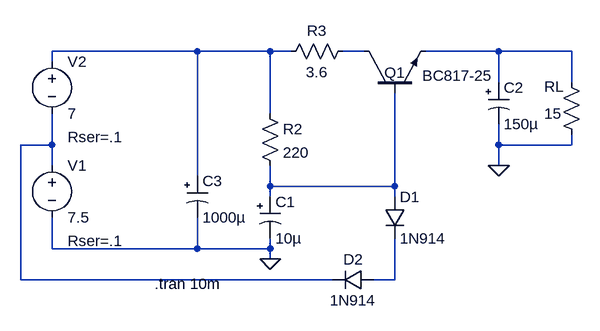
[diagram p0: schematic Ctc7v5Reg.asc]
Ctc7v5Reg.asc, the LTspice schematic file:
Version 4
SHEET 1 880 680
WIRE -96 96 -320 96
WIRE 16 96 -96 96
WIRE 48 96 16 96
WIRE 160 96 128 96
WIRE 368 96 256 96
WIRE 480 96 368 96
WIRE -320 112 -320 96
WIRE 368 144 368 96
WIRE 480 144 480 96
WIRE 16 192 16 96
WIRE -320 240 -320 192
WIRE -320 240 -368 240
WIRE 368 240 368 208
WIRE 480 240 480 224
WIRE 480 240 368 240
WIRE -320 272 -320 240
WIRE 368 272 368 240
WIRE -96 288 -96 96
WIRE 16 304 16 272
WIRE 208 304 208 160
WIRE 208 304 16 304
WIRE 16 320 16 304
WIRE 208 320 208 304
WIRE -320 400 -320 352
WIRE -96 400 -96 352
WIRE -96 400 -320 400
WIRE 16 400 16 384
WIRE 16 400 -96 400
WIRE 16 416 16 400
WIRE -368 448 -368 240
WIRE 112 448 -368 448
WIRE 208 448 208 384
WIRE 208 448 176 448
FLAG 16 416 0
FLAG 368 272 0
SYMBOL npn2 160 160 R270
WINDOW 0 31 32 VRight 0
WINDOW 3 27 90 VRight 0
SYMATTR InstName Q1
SYMATTR Value BC817-25
SYMBOL polcap 0 320 R0
WINDOW 3 24 64 Left 0
SYMATTR InstName C1
SYMATTR Value 10µ
SYMATTR Description Capacitor
SYMATTR Type cap
SYMATTR SpiceLine V=63 Irms=170m Rser=1 Lser=0 mfg="Nichicon" pn="UPG1J100MPH" type="Al electrolytic"
SYMBOL diode 192 320 R0
SYMATTR InstName D1
SYMATTR Value 1N914
SYMBOL res 0 176 R0
SYMATTR InstName R2
SYMATTR Value 220
SYMBOL res 144 80 R90
WINDOW 0 0 56 VBottom 0
WINDOW 3 32 56 VTop 0
SYMATTR InstName R3
SYMATTR Value 3.6
SYMBOL polcap 352 144 R0
WINDOW 3 24 64 Left 0
SYMATTR InstName C2
SYMATTR Value 150µ
SYMATTR Description Capacitor
SYMATTR Type cap
SYMATTR SpiceLine V=10 Irms=265m Rser=0.35 Lser=0 mfg="Nichicon" pn="UPL1A151MPH" type="Al electrolytic"
SYMBOL res 464 128 R0
WINDOW 0 -26 22 Left 0
WINDOW 3 -26 64 Left 0
SYMATTR InstName RL
SYMATTR Value 15
SYMBOL voltage -320 256 R0
WINDOW 123 0 0 Left 0
WINDOW 39 24 132 Left 0
SYMATTR InstName V1
SYMATTR Value 7.5
SYMATTR SpiceLine Rser=.1
SYMBOL voltage -320 96 R0
WINDOW 123 0 0 Left 0
WINDOW 39 24 132 Left 0
SYMATTR InstName V2
SYMATTR Value 7
SYMATTR SpiceLine Rser=.1
SYMBOL polcap -112 288 R0
WINDOW 3 24 64 Left 0
SYMATTR InstName C3
SYMATTR Value 1000µ
SYMATTR Description Capacitor
SYMATTR Type cap
SYMATTR SpiceLine V=16 Irms=1.41 Rser=0.047 Lser=0 mfg="Nichicon" pn="UPL1C102MPH" type="Al electrolytic"
SYMBOL diode 176 432 R90
WINDOW 0 0 32 VBottom 0
WINDOW 3 32 32 VTop 0
SYMATTR InstName D2
SYMATTR Value 1N914
TEXT -162 454 Left 0 !.tran 10m

The netlist it stands for:
* Ctc7v5Reg.asc
Q1 N002 N005 N003 0 BC817-25
C1 N005 0 10µ V=63 Irms=170m Rser=1 Lser=0 mfg="Nichicon" pn="UPG1J100MPH" type="Al electrolytic"
D1 N005 N006 1N914
R2 N001 N005 220
R3 N002 N001 3.6
C2 N003 0 150µ V=10 Irms=265m Rser=0.35 Lser=0 mfg="Nichicon" pn="UPL1A151MPH" type="Al electrolytic"
RL N003 0 15
V1 N004 0 7.5 Rser=.1
V2 N001 N004 7 Rser=.1
C3 N001 0 1000µ V=16 Irms=1.41 Rser=0.047 Lser=0 mfg="Nichicon" pn="UPL1C102MPH" type="Al electrolytic"
D2 N006 N004 1N914
.model D D
.lib standard.dio
.model NPN NPN
.model PNP PNP
.lib standard.bjt
.tran 10m
.backanno
.end